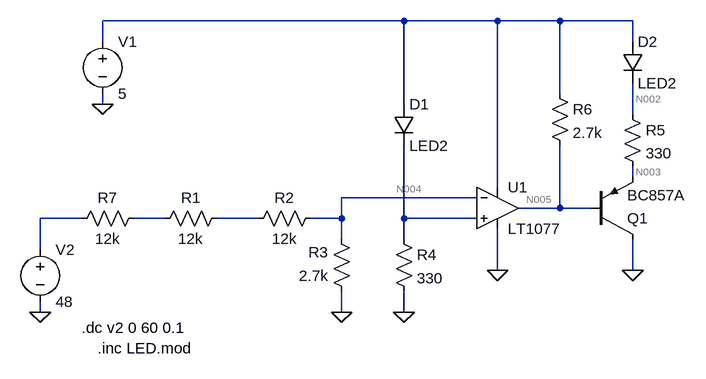
[diagram p0: schematic 48v_detector.asc]
48v_detector.asc, the LTspice schematic file:
Version 4
SHEET 1 880 680
WIRE -128 32 -592 32
WIRE 16 32 -128 32
WIRE 112 32 16 32
WIRE 224 32 112 32
WIRE -592 64 -592 32
WIRE 224 64 224 32
WIRE 112 144 112 32
WIRE -592 160 -592 144
WIRE -128 160 -128 32
WIRE 224 176 224 128
WIRE 224 272 224 256
WIRE 16 288 16 32
WIRE -16 304 -224 304
WIRE 112 320 112 224
WIRE 112 320 48 320
WIRE 160 320 112 320
WIRE -624 336 -688 336
WIRE -496 336 -544 336
WIRE -352 336 -416 336
WIRE -224 336 -224 304
WIRE -224 336 -272 336
WIRE -128 336 -128 224
WIRE -16 336 -128 336
WIRE -224 368 -224 336
WIRE -128 368 -128 336
WIRE -688 384 -688 336
WIRE 16 416 16 352
WIRE 224 416 224 368
WIRE -688 480 -688 464
WIRE -224 480 -224 448
WIRE -128 480 -128 448
FLAG -592 160 0
FLAG -688 480 0
FLAG 16 416 0
FLAG -224 480 0
FLAG -128 480 0
FLAG 224 416 0
SYMBOL voltage -592 48 R0
WINDOW 123 0 0 Left 2
WINDOW 39 0 0 Left 2
SYMATTR InstName V1
SYMATTR Value 5
SYMBOL voltage -688 368 R0
WINDOW 123 0 0 Left 2
WINDOW 39 0 0 Left 2
SYMATTR InstName V2
SYMATTR Value 48
SYMBOL pnp 160 368 M180
SYMATTR InstName Q1
SYMATTR Value BC857A
SYMBOL Opamps\\LT1077 16 256 R0
SYMATTR InstName U1
SYMBOL res -400 320 R90
WINDOW 0 0 56 VBottom 2
WINDOW 3 32 56 VTop 2
SYMATTR InstName R1
SYMATTR Value 12k
SYMBOL res -256 320 R90
WINDOW 0 0 56 VBottom 2
WINDOW 3 32 56 VTop 2
SYMATTR InstName R2
SYMATTR Value 12k
SYMBOL res -208 464 R180
WINDOW 0 36 76 Left 2
WINDOW 3 36 40 Left 2
SYMATTR InstName R3
SYMATTR Value 2.7k
SYMBOL res -144 352 R0
SYMATTR InstName R4
SYMATTR Value 330
SYMBOL res 208 160 R0
SYMATTR InstName R5
SYMATTR Value 330
SYMBOL res 96 128 R0
SYMATTR InstName R6
SYMATTR Value 2.7k
SYMBOL res -528 320 R90
WINDOW 0 0 56 VBottom 2
WINDOW 3 32 56 VTop 2
SYMATTR InstName R7
SYMATTR Value 12k
SYMBOL diode -144 160 R0
SYMATTR InstName D1
SYMATTR Value LED2
SYMBOL diode 208 64 R0
SYMATTR InstName D2
SYMATTR Value LED2
TEXT -624 504 Left 2 !.dc v2 0 60 0.1
TEXT -600 536 Left 2 !.inc LED.mod

The netlist it stands for:
* 48v_detector.asc
V1 N001 0 5
V2 N006 0 48
Q1 0 N005 N003 0 BC857A
XU1 N009 N004 N001 0 N005 LT1077  ; pins In+ In- V+ V- OUT
R1 N008 N007 12k
R2 N004 N008 12k
R3 0 N004 2.7k
R4 N009 0 330
R5 N002 N003 330
R6 N001 N005 2.7k
R7 N007 N006 12k
D1 N001 N009 LED2
D2 N001 N002 LED2
.model D D
.lib standard.dio
.model NPN NPN
.model PNP PNP
.lib standard.bjt
.dc v2 0 60 0.1
.inc LED.mod
.backanno
.end

* Results of the author's LTspice run, read from the files saved beside the schematic
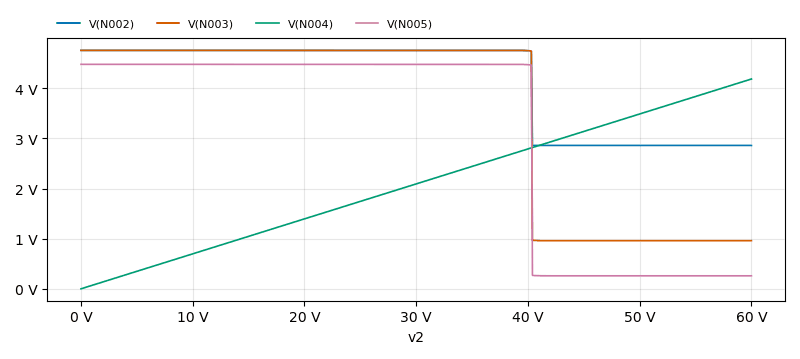
[diagram p1: DC transfer characteristic of 48v_detector.asc, plotted from the saved traces]
* DC transfer characteristic, 1 run:
*   V(N002): 4.757 V at v2=0 V, 2.861 V at v2=60 V, min 2.861 V, max 4.757 V
*   V(N003): 4.757 V at v2=0 V, 959.5 mV at v2=60 V, min 959.5 mV, max 4.757 V
*   V(N004): 23.84 µV at v2=0 V, 4.186 V at v2=60 V, min 23.84 µV, max 4.186 V
*   V(N005): 4.479 V at v2=0 V, 259 mV at v2=60 V, min 259 mV, max 4.479 V